# EAGLE schematic CD40106-4069-Synth (EAGLE 7.6.0)
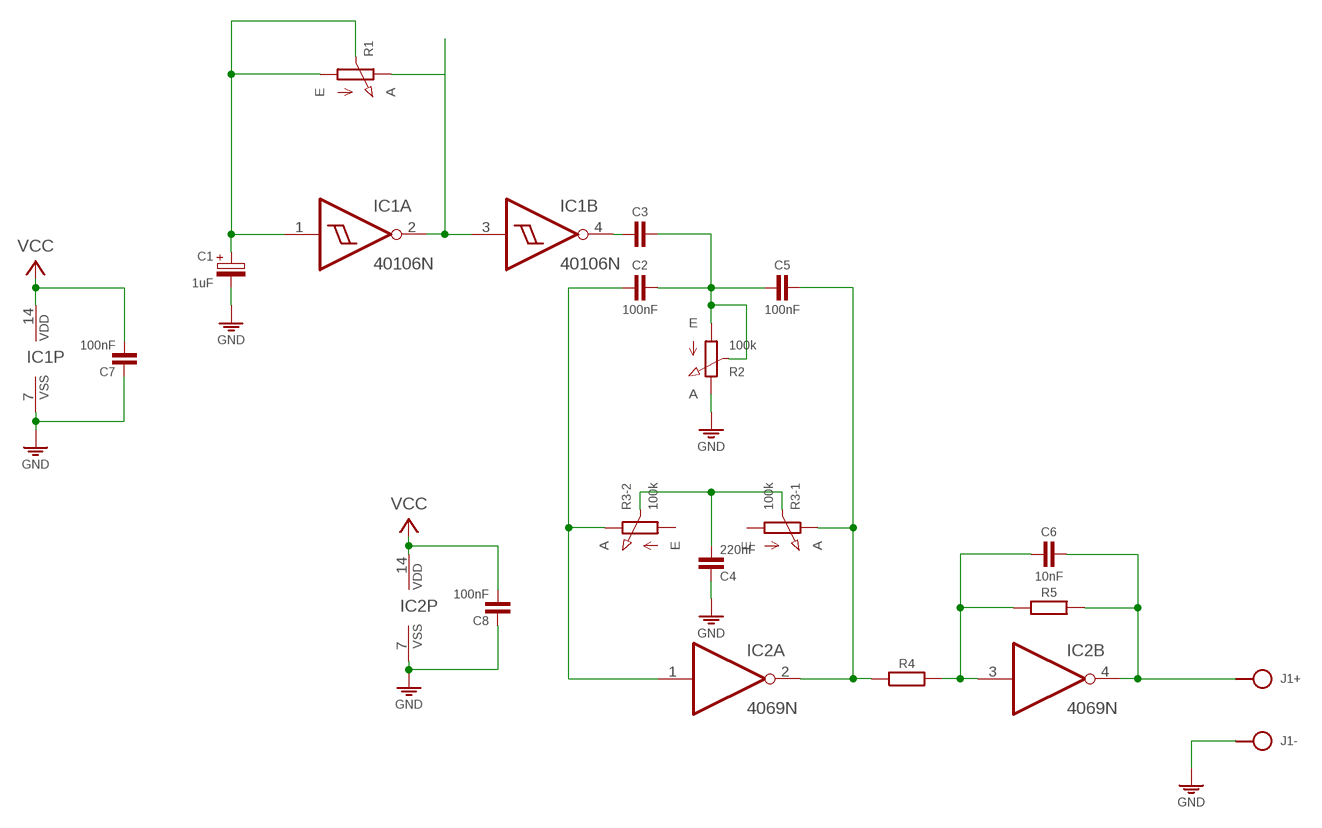
[diagram p0: schematic, sheet 1]

## Parts
C1  1uF  CPOLE2,5-4/V  [E2.5-4/V]
C2  100nF  C-H050-020X044  [C050-020X044]
C3  C-H050-020X044  [C050-020X044]
C4  220nF  C050-020X044/V  [C050-020X044/V]
C5  100nF  C-H050-020X044  [C050-020X044]
C6  10nF  C-H050-020X044  [C050-020X044]
C7  100nF  C050-020X044/V  [C050-020X044/V]
C8  100nF  C050-020X044/V  [C050-020X044/V]
IC1  40106N  [DIL14]
IC2  4069N  [DIL14]
J1  SPAD+-+-  [SPAD+-]
J2  VCC_GNDL  [SPAD-+]
R1  POT  [POT]
R2  100k  POT  [POT]
R3  100k  POT-STEREO  [POT-STEREO-2X3]
R4  R-H0204/2-V  [0204V]
R5  R-H0204/10-V  [0204/10-V]

## Nets
GND: C1.- C4.1 C7.1 C8.1 IC1.7(P:VSS) IC2.7(P:VSS) J1.1 J2.1 R2.3(E)
N$1: C3.1 IC1.4(B:O)
N$2: C1.+ IC1.1(A:I) R1.1(A) R1.2(S)
N$3: IC1.2(A:O) IC1.3(B:I) R1.3(E)
N$4: C2.2 C3.2 C5.1 R2.1(A) R2.2(S)
N$5: C5.2 IC2.2(A:O) R3.1-E(-1:E) R4.1
N$6: C2.1 IC2.1(A:I) R3.2-E(-2:E)
N$7: C6.1 IC2.3(B:I) R4.2 R5.1
N$9: C6.2 IC2.4(B:O) J1.2 R5.2
N$11: C4.2 R3.1-S(-1:S) R3.2-S(-2:S)
VCC: C7.2 C8.2 IC1.14(P:VDD) IC2.14(P:VDD) J2.2
Unconnected: IC1.5(C:I) IC1.6(C:O) IC1.8(D:O) IC1.9(D:I) IC1.10(E:O) IC1.11(E:I) IC1.12(F:O) IC1.13(F:I) IC2.5(C:I) IC2.6(C:O) IC2.8(D:O) IC2.9(D:I) IC2.10(E:O) IC2.11(E:I) IC2.12(F:O) IC2.13(F:I) R3.1-A(-1:A) R3.2-A(-2:A)

## Library data of the parts
C1 = c:CPOL: POLARIZED CAPACITOR, European symbol
C2 C3 C5 C6 = c:C-H
C4 C7 C8 = c:C: CAPACITOR, European symbol
IC1 = ic:40106: CMOS Logic Devices, 4000 Series Based on the following sources: Motorola CMOS LOGIC DATA; book, 02/88, DL131 REV 1 http://www.elexp.com http://www.intersil.com http://www.ls3c.com.tw/product/1/COMOS.html Created by librarian@cadsoft.de
IC2 = ic:4069: Hex INVERTER
J1 = pad:SPAD+-
J2 = pad:VCC_GND
R1 R2 = r:POT
R3 = r:POT-STEREO
R4 R5 = r:R-H

## Net classes
0 default: width 0.61 mm